# Altium schematic sheet main_board.SchDoc
size A4
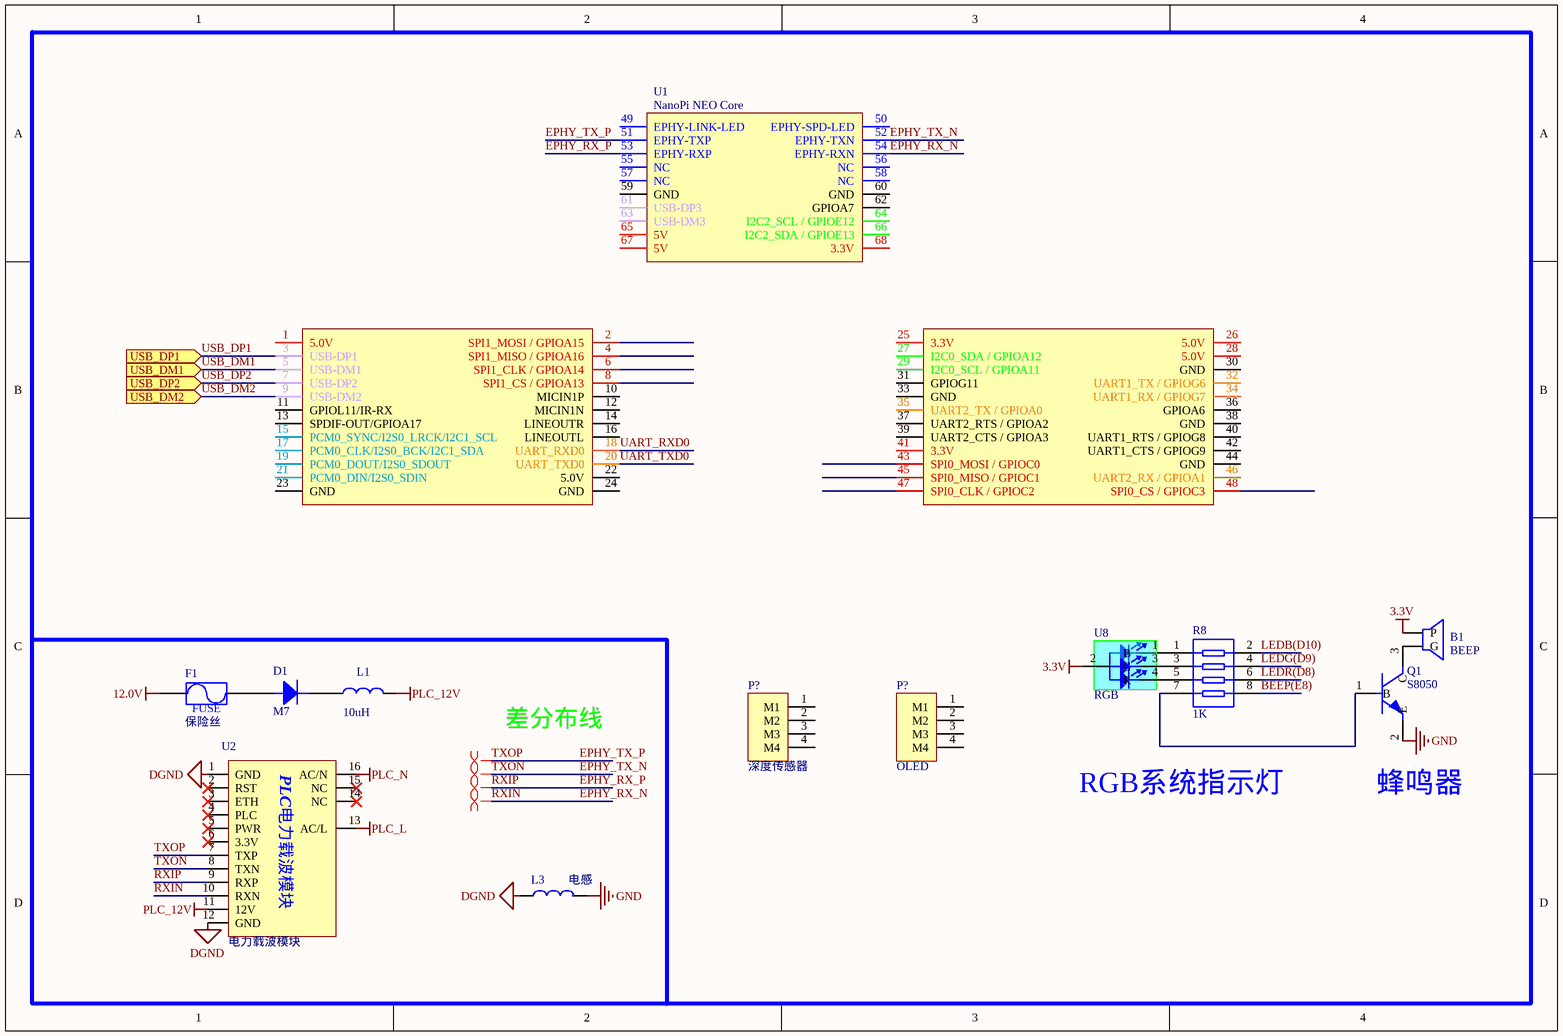
[diagram p0: main_board.SchDoc]

## Parts
(Parts that share a designator on the sheet are numbered #1, #2 ... from top to bottom, then left to right.)
B1  BEEP  [BUZZER]
D1  M7  [SMA/DO-214AC]
F1  保险丝  [FUSE-1206]
L1  10uH  [1206L]
L3  电感  [1206L]
P?#1  深度传感器  [MX1.25WS-4P]
P?#2  OLED  [OLED12864]
Q1  S8050  [SOT-23]
R8  1K  [排阻(4位贴片)]
U1  NanoPi NEO Core  [NanoPi NEO Core]
U2  电力载波模块  [电力载波模块6410]
U8  RGB  [RGB-3528]

## Ports
USB_DM1 (in), USB_DM2 (in), USB_DP1 (in), USB_DP2 (in)

## Nets
3.3V: B1.1(P) U8.2
12.0V: F1.1
DGND: L3.1 U2.1(GND) U2.12(GND)
GND: L3.2 Q1.2(E)
PLC_12V: L1.2 U2.11(12V)
PLC_L: U2.13(AC/L)
PLC_N: U2.16(AC/N)
BEEP(E8): R8.8
EPHY_RX_N: U1.54(EPHY-RXN) U2.10(RXN)  [also labelled RXIN]
EPHY_RX_P: U1.53(EPHY-RXP) U2.9(RXP)  [also labelled RXIP]
EPHY_TX_N: U1.52(EPHY-TXN) U2.8(TXN)  [also labelled TXON]
EPHY_TX_P: U1.51(EPHY-TXP) U2.7(TXP)  [also labelled TXOP]
LEDB(D10): R8.2
LEDG(D9): R8.4
LEDR(D8): R8.6
UART_RXD0: U1.18(UART_RXD0)
UART_TXD0: U1.20(UART_TXD0)
USB_DM1: U1.5(USB-DM1) ; port USB_DM1
USB_DM2: U1.9(USB-DM2) ; port USB_DM2
USB_DP1: U1.3(USB-DP1) ; port USB_DP1
USB_DP2: U1.7(USB-DP2) ; port USB_DP2
NetB1_2: B1.2(G) Q1.3(C)
NetD1_1: D1.1 F1.2
NetD1_2: D1.2 L1.1
NetQ1_1: Q1.1(B) R8.7
NetR8_1: R8.1 U8.1(B)
NetR8_3: R8.3 U8.3(G)
NetR8_5: R8.5 U8.4(R)

Not connected (* = marked no-connect by the designer): P?#1 1(M1) 2(M2) 3(M3) 4(M4); P?#2 1(M1) 2(M2) 3(M3) 4(M4); U1 1(5.0V) 2(SPI1_MOSI_/_GPIOA15) 4(SPI1_MISO_/_GPIOA16) 6(SPI1_CLK_/_GPIOA14) 8(SPI1_CS_/_GPIOA13) 10(MICIN1P) 11(GPIOL11/IR-RX) 12(MICIN1N) 13(SPDIF-OUT/GPIOA17) 14(LINEOUTR) 15(PCM0_SYNC/I2S0_LRCK/I2C1_SCL) 16(LINEOUTL) 17(PCM0_CLK/I2S0_BCK/I2C1_SDA) 19(PCM0_DOUT/I2S0_SDOUT) 21(PCM0_DIN/I2S0_SDIN) 22(5.0V) 23(GND) 24(GND) 25(3.3V) 26(5.0V) 27(I2C0_SDA_/_GPIOA12) 28(5.0V) 29(I2C0_SCL_/_GPIOA11) 30(GND) 31(GPIOG11) 32(UART1_TX_/_GPIOG6) 33(GND) 34(UART1_RX_/_GPIOG7) 35(UART2_TX_/_GPIOA0) 36(GPIOA6) 37(UART2_RTS_/_GPIOA2) 38(GND) 39(UART2_CTS_/_GPIOA3) 40(UART1_RTS_/_GPIOG8) 41(3.3V) 42(UART1_CTS_/_GPIOG9) 43(SPI0_MOSI_/_GPIOC0) 44(GND) 45(SPI0_MISO_/_GPIOC1) 46(UART2_RX_/_GPIOA1) 47(SPI0_CLK_/_GPIOC2) 48(SPI0_CS_/_GPIOC3) 49(EPHY-LINK-LED) 50(EPHY-SPD-LED) 55(NC) 56(NC) 57(NC) 58(NC) 59(GND) 60(GND) 61(USB-DP3) 62(GPIOA7) 63(USB-DM3) 64(I2C2_SCL_/_GPIOE12) 65(5V) 66(I2C2_SDA_/_GPIOE13) 67(5V) 68(3.3V); U2 2(RST)* 3(ETH)* 4(PLC)* 5(PWR)* 6(3.3V)* 14(NC)* 15(NC)*

## Layout directives
differential pair: EPHY_RX_N, EPHY_RX_P, EPHY_TX_N, EPHY_TX_P

## Notes on the sheet
- 差分布线
- RGB系统指示灯
- (near Q1) 蜂鸣器
- (in symbol Fuse) FUSE
- (in symbol 电力载波模块6410) PLC电力载波模块

## Library data of the parts
D1 = Diode: 二极管
F1 = Fuse
L1 = L: 电感
L3 = L
P?#1 P?#2 = 接线端子-4PIN: 4PIN
Q1 = NPN: NPN三极管
R8 = Res-4: 排阻
U2 = 电力载波模块6410